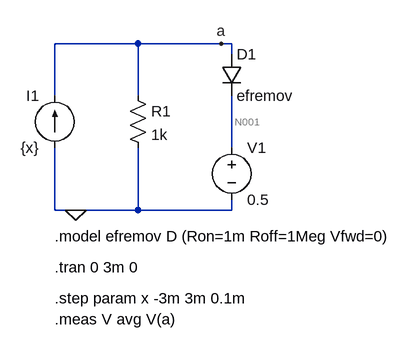
[diagram p0: schematic task_2b.asc]
task_2b.asc, the LTspice schematic file:
Version 4
SHEET 1 880 680
WIRE 192 96 64 96
WIRE 320 96 192 96
WIRE 336 96 320 96
WIRE 336 112 336 96
WIRE 64 176 64 96
WIRE 192 176 192 96
WIRE 336 256 336 176
WIRE 64 352 64 256
WIRE 96 352 64 352
WIRE 192 352 192 256
WIRE 192 352 96 352
WIRE 336 352 336 336
WIRE 336 352 192 352
FLAG 96 352 0
FLAG 320 96 a
SYMBOL current 64 256 R180
WINDOW 0 24 80 Left 2
WINDOW 3 24 0 Left 2
WINDOW 123 24 -28 Left 2
WINDOW 39 0 0 Left 0
SYMATTR InstName I1
SYMATTR Value {x}
SYMBOL res 176 160 R0
SYMATTR InstName R1
SYMATTR Value 1k
SYMBOL diode 320 112 R0
SYMATTR InstName D1
SYMATTR Value efremov
SYMBOL voltage 336 240 R0
WINDOW 123 24 124 Left 2
WINDOW 39 0 0 Left 0
SYMATTR InstName V1
SYMATTR Value 0.5
TEXT 64 440 Left 2 !.tran 0 3m 0
TEXT 64 392 Left 2 !.model efremov D (Ron=1m Roff=1Meg Vfwd=0)
TEXT 64 488 Left 2 !.step param x -3m 3m 0.1m
TEXT 64 520 Left 2 !.meas V avg V(a)

The netlist it stands for:
* task_2b.asc
I1 0 a {x}
R1 a 0 1k
D1 a N001 efremov
V1 N001 0 0.5
.model D D
.lib standard.dio
.tran 0 3m 0
.model efremov D (Ron=1m Roff=1Meg Vfwd=0)
.step param x -3m 3m 0.1m
.meas V avg V(a)
.backanno
.end

* Results of the author's LTspice run, read from the files saved beside the schematic
* Operating Point (first step), zero values left out:
*   x = -3 m
*   V(a) = -2.997 V
*   V(n001) = 500 mV
*   I(D1) = -3.497 µA
*   I(I1) = -3 mA
*   I(R1) = -2.997 mA
*   I(V1) = -3.497 µA
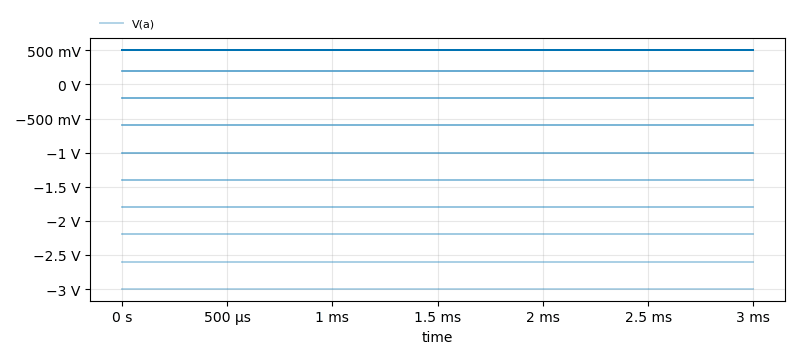
[diagram p1: Transient Analysis of task_2b.asc, plotted from the saved traces]
* Transient Analysis, 61 runs:
*   V(a) [run 1]: min -2.997 V, max -2.997 V, average -2.997 V, rms 2.997 V, last -2.997 V
*   V(a) [run 2]: min -2.597 V, max -2.597 V, average -2.597 V, rms 2.597 V, last -2.597 V
*   V(a) [run 3]: min -2.197 V, max -2.197 V, average -2.197 V, rms 2.197 V, last -2.197 V
*   V(a) [run 4]: min -1.798 V, max -1.798 V, average -1.798 V, rms 1.798 V, last -1.798 V
*   V(a) [run 5]: min -1.398 V, max -1.398 V, average -1.398 V, rms 1.398 V, last -1.398 V
*   V(a) [run 6]: min -998.5 mV, max -998.5 mV, average -998.5 mV, rms 998.5 mV, last -998.5 mV
*   V(a) [run 7]: min -598.9 mV, max -598.9 mV, average -598.9 mV, rms 598.9 mV, last -598.9 mV
*   V(a) [run 8]: min -199.3 mV, max -199.3 mV, average -199.3 mV, rms 199.3 mV, last -199.3 mV
* From the log:
*   Measurement: v
*     step  AVG(v(a))  FROM  TO
*        1  -2.9965  0  0.003
*        2  -2.8966  0  0.003
*        3  -2.7967  0  0.003
*        4  -2.6968  0  0.003
*        5  -2.5969  0  0.003
*        6  -2.497  0  0.003
*        7  -2.3971  0  0.003
*        8  -2.2972  0  0.003
*        9  -2.1973  0  0.003
*       10  -2.0974  0  0.003
*       11  -1.9975  0  0.003
*       12  -1.8976  0  0.003
*       13  -1.7977  0  0.003
*       14  -1.6978  0  0.003
*       15  -1.5979  0  0.003
*       16  -1.498  0  0.003
*       17  -1.3981  0  0.003
*       18  -1.2982  0  0.003
*       19  -1.1983  0  0.003
*       20  -1.0984  0  0.003
*       21  -0.998501  0  0.003
*       22  -0.898601  0  0.003
*       23  -0.798701  0  0.003
*       24  -0.698801  0  0.003
*       25  -0.598901  0  0.003
*       26  -0.499001  0  0.003
*       27  -0.399101  0  0.003
*       28  -0.299201  0  0.003
*       29  -0.199301  0  0.003
*       30  -0.0994006  0  0.003
*       31  0.0004995  0  0.003
*       32  0.1004  0  0.003
*       33  0.2003  0  0.003
*       34  0.3002  0  0.003
*       35  0.4001  0  0.003
*       36  0.5  0  0.003
*       37  0.5  0  0.003
*       38  0.5  0  0.003
*       39  0.5  0  0.003
*       40  0.5  0  0.003
*     ...